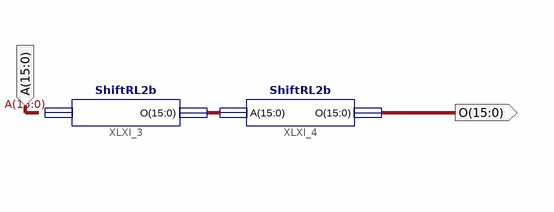
[diagram p0: schematic sheet 1]
// Xilinx ISE schematic ShiftRL4b.sch (spartan3e) as structural Verilog: 2 symbols, 2 ports
module ShiftRL4b (
  input  [15:0] A,
  output [15:0] O
);

  wire [15:0] XLXN_2;

  ShiftRL2b XLXI_3 (.O(XLXN_2));  // open: A
  ShiftRL2b XLXI_4 (.A(XLXN_2), .O(O));
endmodule
